# EAGLE schematic alimentation 220V (EAGLE 9.6.2)
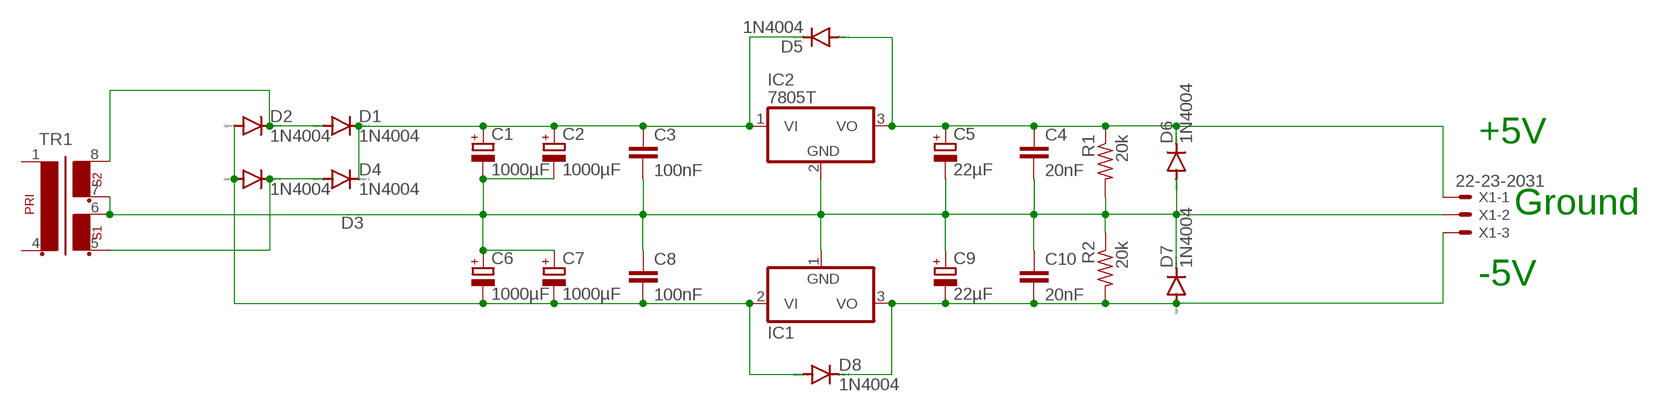
[diagram p0: schematic, sheet 1]

## Parts
C1  1000µF  CPOL-EU140CLH-0810  [140CLH-0810]
C2  1000µF  CPOL-EU140CLH-0810  [140CLH-0810]
C3  100nF  C2,5-3  [C2.5-3]
C4  20nF  C2,5-3  [C2.5-3]
C5  22µF  CPOL-EU140CLH-0810  [140CLH-0810]
C6  1000µF  CPOL-EU140CLH-0810  [140CLH-0810]
C7  1000µF  CPOL-EU140CLH-0810  [140CLH-0810]
C8  100nF  C2,5-3  [C2.5-3]
C9  22µF  CPOL-EU140CLH-0810  [140CLH-0810]
C10  20nF  C2,5-3  [C2.5-3]
D1  1N4004  [DO41-10]
D2  1N4004  [DO41-10]
D3  1N4004  [DO41-10]
D4  1N4004  [DO41-10]
D5  1N4004  [DO41-10]
D6  1N4004  [DO41-10]
D7  1N4004  [DO41-10]
D8  1N4004  [DO41-10]
IC1  7905T  [TO220H]
IC2  7805T  [TO220H]
R1  20k  R-US_0204/7  [0204/7]
R2  20k  R-US_0204/7  [0204/7]
TR1  EE20-2  [EE20-2]
X1  22-23-2031  [22-23-2031]

## Nets
N$1: C4.1 C5.+ D5.A D6.C IC2.3(VO) R1.1 X1.1
N$2: C6.- C7.- C8.2 D2.A D3.A D8.A IC1.2(VI)
N$3: D1.A D2.C TR1.8
N$4: D3.C D4.A TR1.5
N$5: C1.+ C2.+ C3.1 D1.C D4.C D5.C IC2.1(VI)
N$6: C1.- C2.- C3.2 C4.2 C5.- C6.+ C7.+ C8.1 C9.+ C10.1 D6.A D7.C IC1.1(GND) IC2.2(GND) R1.2 R2.1 TR1.6 TR1.7 X1.2
N$7: C9.- C10.2 D7.A D8.C IC1.3(VO) R2.2 X1.3
Unconnected: TR1.1 TR1.4

## Notes on the sheet
- +5V
- Ground
- -5V

## Library data of the parts
C1 C2 C5-C7 C9 = rcl:CPOL-EU: POLARIZED CAPACITOR, European symbol; SPICEPREFIX: C
C3 C4 C8 C10 = capacitor-wima:C: CAPACITOR naming: grid - package width
D1-D8 = diode:1N4004: DIODE general purpose rectifier, 1 A
IC1 = linear:79*: Negative VOLTAGE REGULATOR
IC2 = linear:78*: Positive VOLTAGE REGULATOR Source: http://cache.national.com/ds/LM/LM78L05.pdf http://www.fairchildsemi.com/ds/LM/LM7805.pdf
R1 R2 = rcl:R-US_: RESISTOR, American symbol; SPICEPREFIX: R
TR1 = trafo:EE20-2: TRANSFORMER 1 primary winding, 2 secondary windings ERA
X1 = con-molex:22-23-2031: .100" (2.54mm) Center Header - 3 Pin; MF: MOLEX; MPN: 22-23-2031; OC_FARNELL: 1462950; OC_NEWARK: 30C0862